# EAGLE schematic common emitter_se (EAGLE 9.6.2)
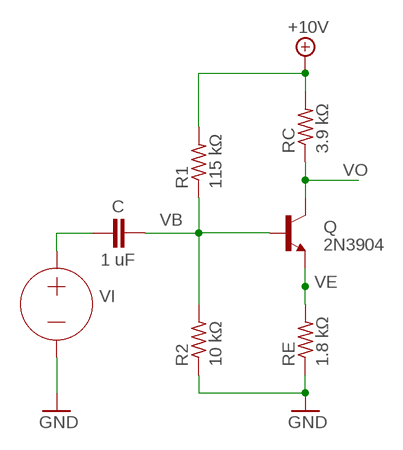
[diagram p0: schematic, sheet 1]

## Parts
C  1 uF  C-EU025-024X044  [C025-024X044]
Q  2N3904  [TO92]
R1  115 kΩ  R-US_0204/5  [0204/5]
R2  10 kΩ  R-US_0204/5  [0204/5]
RC  3.9 kΩ  R-US_0204/5  [0204/5]
RE  1.8 kΩ  R-US_0204/5  [0204/5]
VI  0V  VOLTAGE  (no package)

## Nets
+10V: R1.2 RC.2
GND: R2.1 RE.1 VI.-
N$1: C.1 VI.+
VB: C.2 Q.2(B) R1.1 R2.2
VE: Q.3(E) RE.2
VO: Q.1(C) RC.1

## Library data of the parts
C = rcl:C-EU: CAPACITOR, European symbol; SPICEPREFIX: C
Q = transistor:2N3904: NPN TRANSISTOR
R1 R2 RC RE = rcl:R-US_: RESISTOR, American symbol; SPICEPREFIX: R
VI = ngspice-simulation:VOLTAGE: Independent Voltage Source, either DC, AC, PULSE, SINE, PWL, EXP, or SFFM